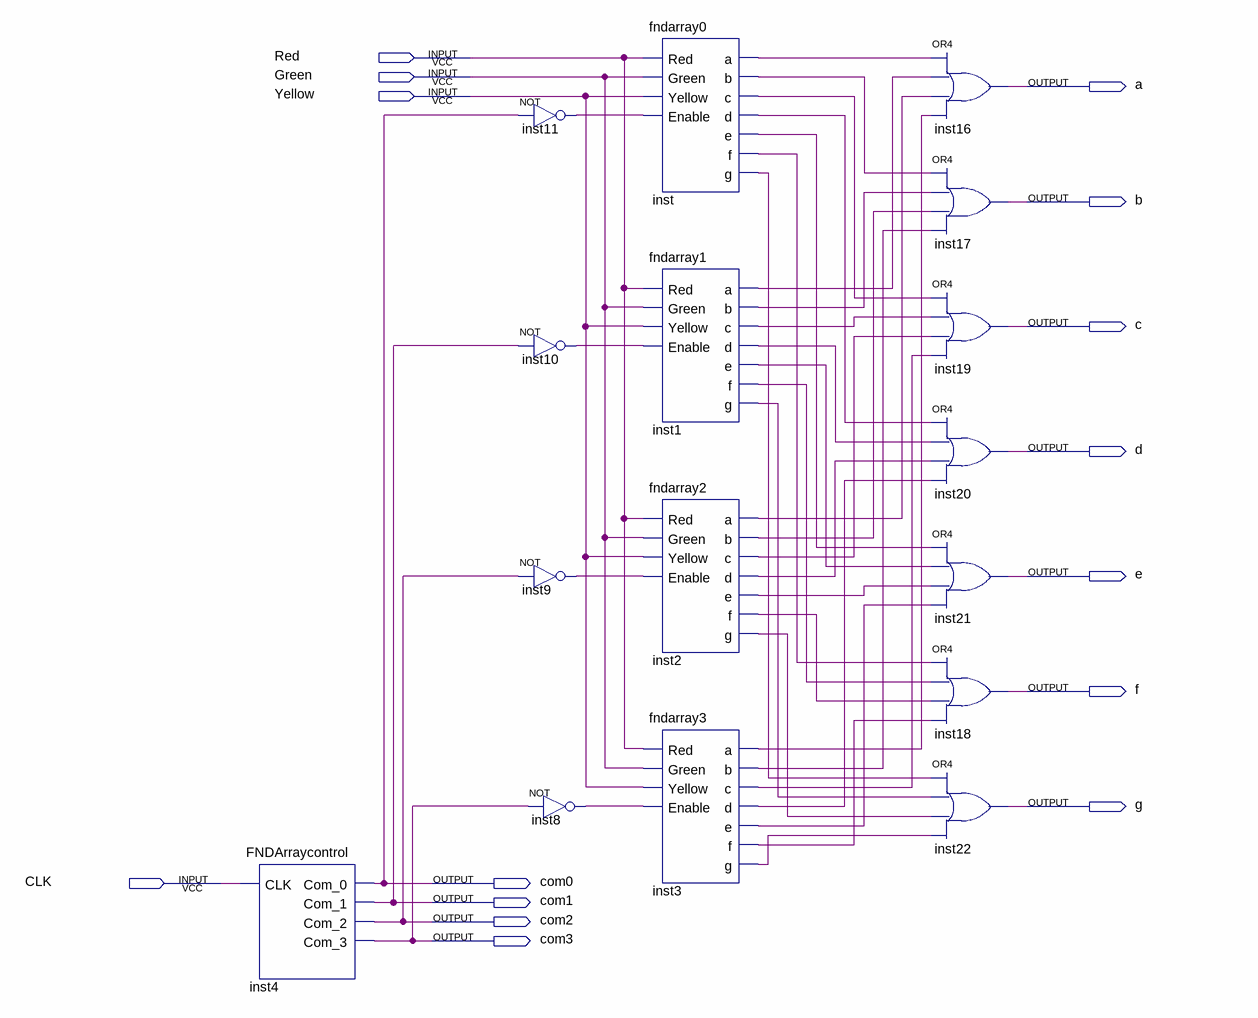
[diagram p0: schematic sheet]
// Quartus schematic FNDArray0_4.bdf as structural Verilog: 16 symbols, 15 pins
module FNDArray0_4 (
  input  Red,
  input  Green,
  input  Yellow,
  input  CLK,
  output a,
  output b,
  output c,
  output d,
  output e,
  output f,
  output g,
  output com0,
  output com1,
  output com2,
  output com3
);

  wire inst1_a, inst1_b, inst1_c, inst1_d, inst1_e, inst1_f, inst1_g, inst2_a, inst2_b, inst2_c, inst2_d,
       inst2_e, inst2_f, inst2_g, inst3_a, inst3_b, inst3_c, inst3_d, inst3_e, inst3_f, inst3_g, inst8_out,
       inst9_out, inst10_out, inst11_out, inst_a, inst_b, inst_c, inst_d, inst_e, inst_f, inst_g;

  FNDArraycontrol inst4 (.CLK(CLK), .Com_0(com0), .Com_1(com1), .Com_2(com2), .Com_3(com3));
  not inst11 (inst11_out, com0);
  not inst10 (inst10_out, com1);
  not inst9 (inst9_out, com2);
  not inst8 (inst8_out, com3);
  fndarray0 inst (
    .Red(Red), .Green(Green), .Yellow(Yellow), .Enable(inst11_out), .a(inst_a), .b(inst_b), .c(inst_c),
    .d(inst_d), .e(inst_e), .f(inst_f), .g(inst_g));
  fndarray1 inst1 (
    .Red(Red), .Green(Green), .Yellow(Yellow), .Enable(inst10_out), .a(inst1_a), .b(inst1_b), .c(inst1_c),
    .d(inst1_d), .e(inst1_e), .f(inst1_f), .g(inst1_g));
  fndarray2 inst2 (
    .Red(Red), .Green(Green), .Yellow(Yellow), .Enable(inst9_out), .a(inst2_a), .b(inst2_b), .c(inst2_c),
    .d(inst2_d), .e(inst2_e), .f(inst2_f), .g(inst2_g));
  fndarray3 inst3 (
    .Red(Red), .Green(Green), .Yellow(Yellow), .Enable(inst8_out), .a(inst3_a), .b(inst3_b), .c(inst3_c),
    .d(inst3_d), .e(inst3_e), .f(inst3_f), .g(inst3_g));
  or inst16 (a, inst_a, inst1_a, inst2_a, inst3_a);
  or inst17 (b, inst_b, inst1_b, inst2_b, inst3_b);
  or inst19 (c, inst_c, inst1_c, inst2_c, inst3_c);
  or inst20 (d, inst_d, inst1_d, inst2_d, inst3_d);
  or inst21 (e, inst_e, inst1_e, inst2_e, inst3_e);
  or inst18 (f, inst_f, inst1_f, inst2_f, inst3_f);
  or inst22 (g, inst_g, inst1_g, inst2_g, inst3_g);
endmodule
